# Altium schematic sheet Input_Output_Filtering.SchDoc
size A2; SheetNumber: 11; SheetTotal: 13
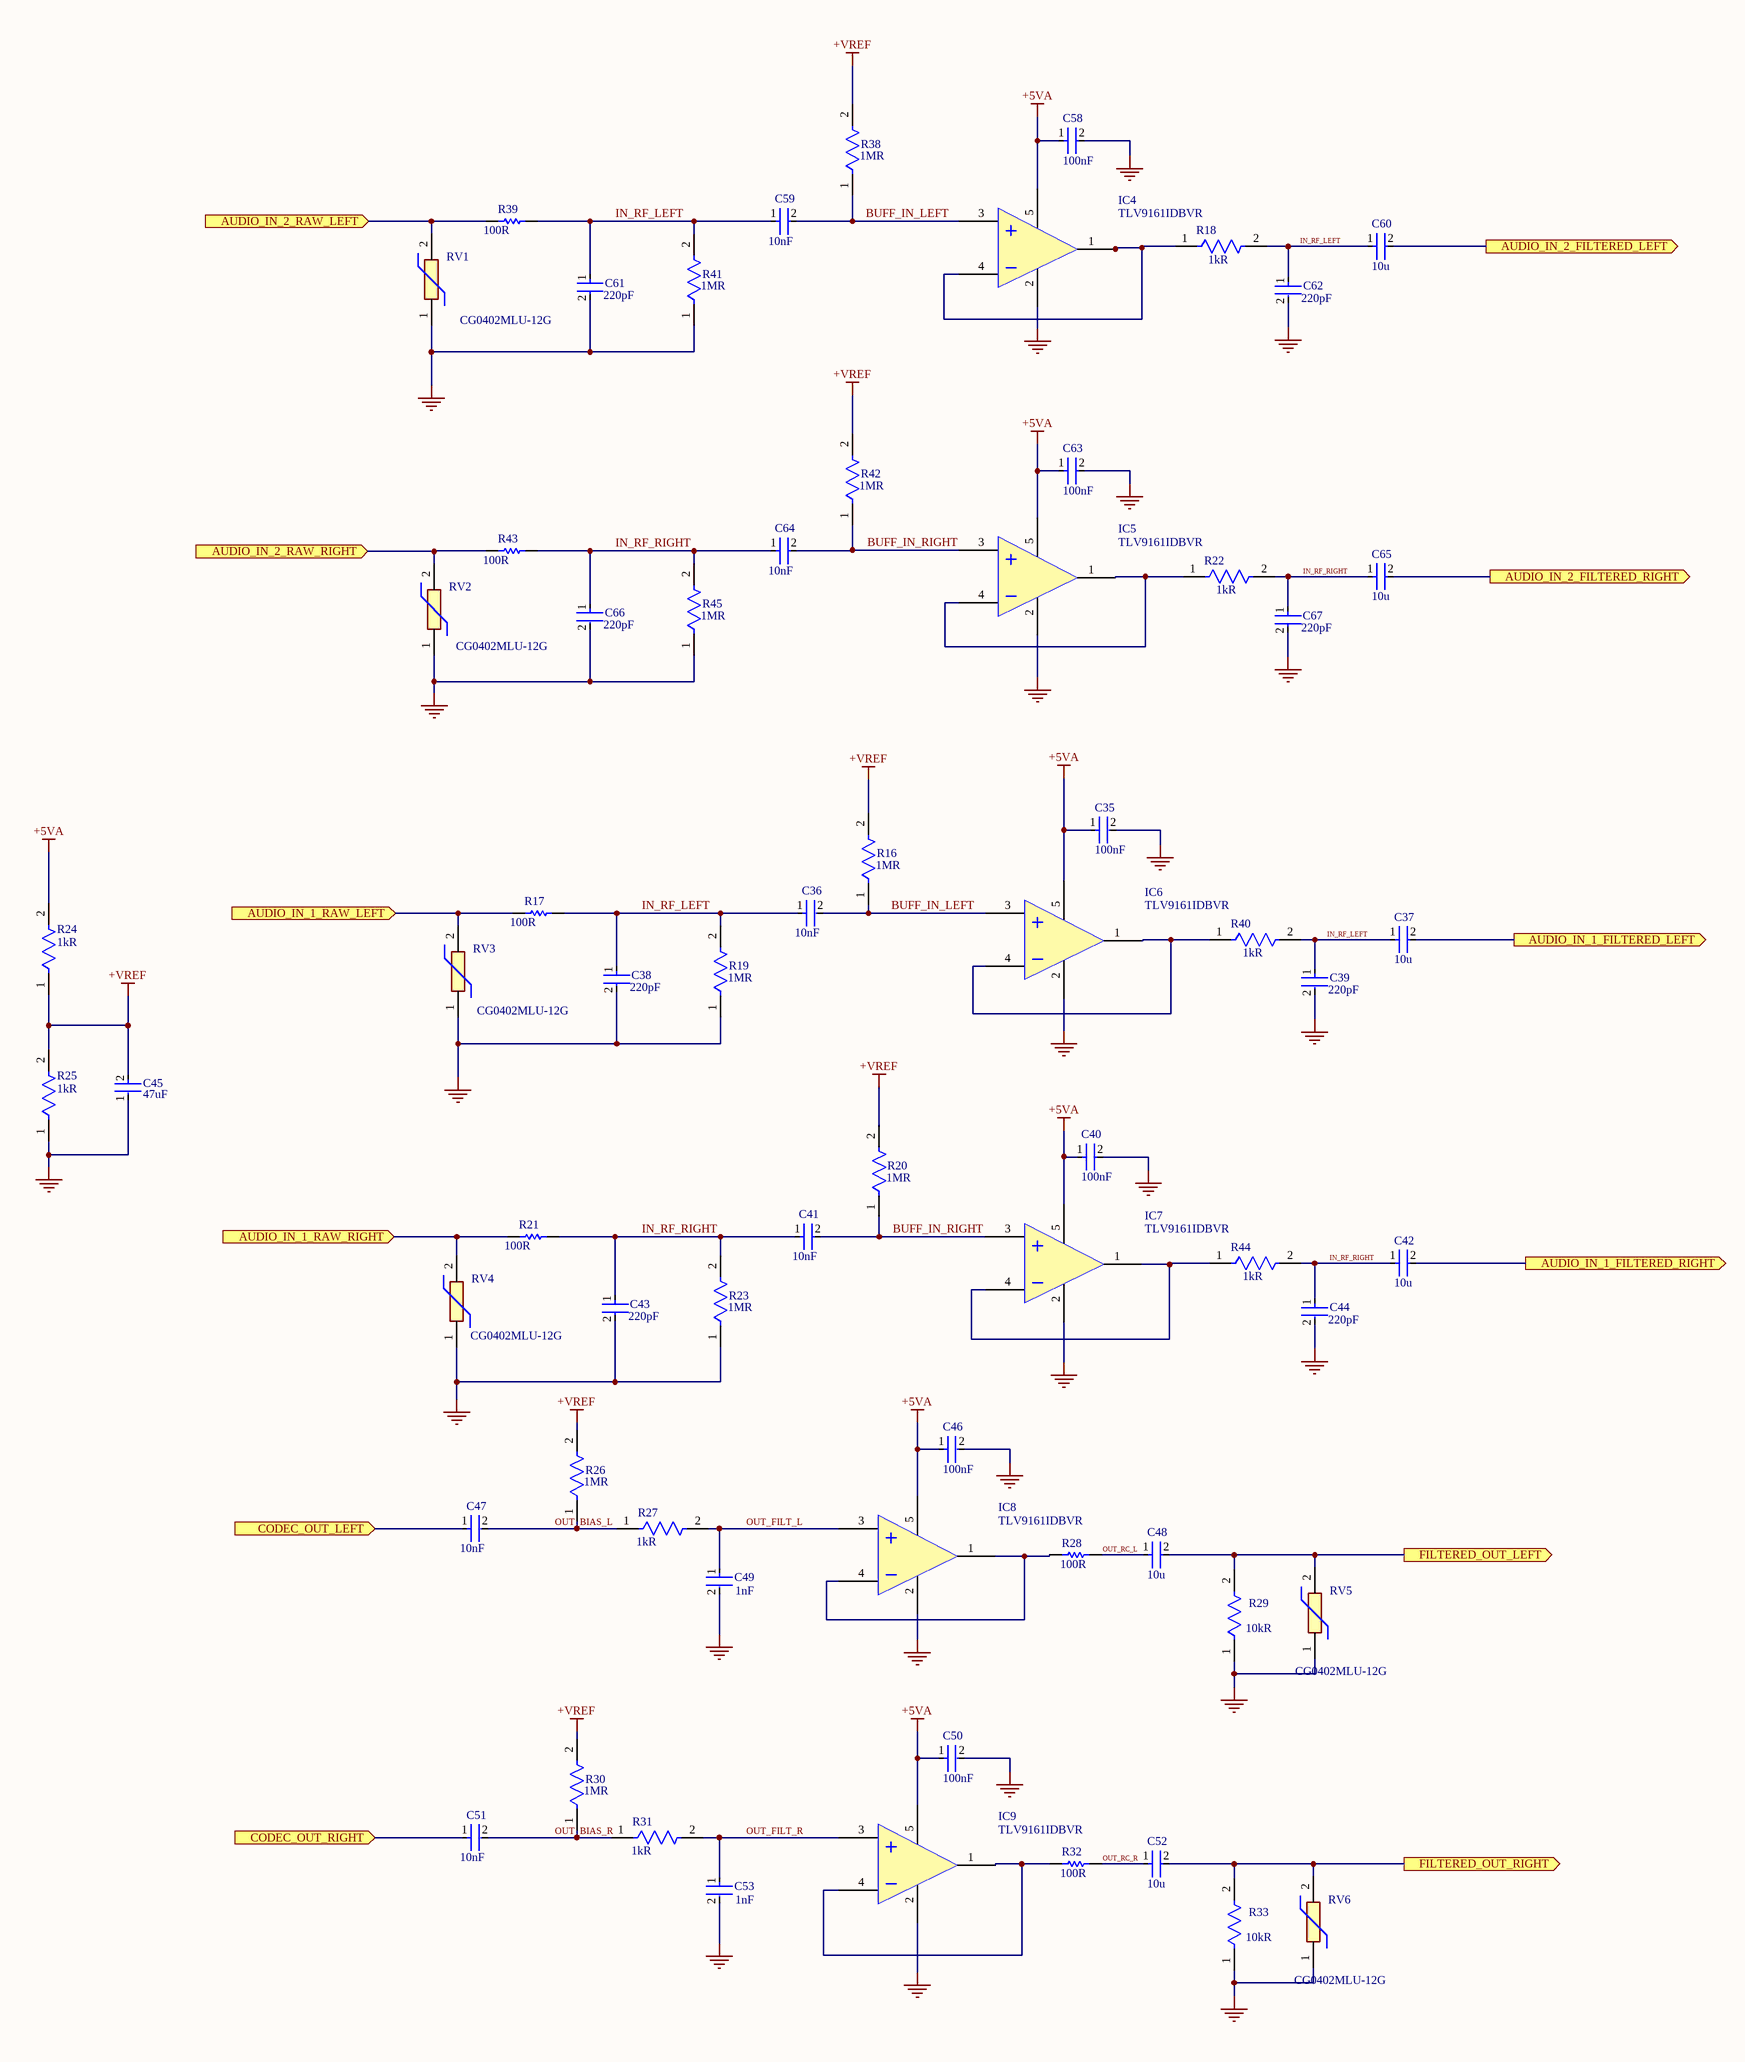
[diagram p0: Input_Output_Filtering.SchDoc]

## Parts
C35  Capacitance: 100nF  [FP-GRM033-0_03-IPC_C]  (hidden comment: GRM033C71C104ME14J)
C36  Capacitance: 10nF  [FP-GCM155-0_05-MFG]  (hidden comment: GCM155R71H103KA55W)
C37  Capacitor: 10u  [FP-GCM188-0_2-IPC_A]  (hidden comment: GCM188D70G106ME36J)
C38  Capacitance: 220pF  [FP-GCM155-0_05-IPC_B]  (hidden comment: GCM155R71H221KA37J)
C39  Capacitance: 220pF  [FP-GCM155-0_05-IPC_B]  (hidden comment: GCM155R71H221KA37J)
C40  Capacitance: 100nF  [FP-GRM033-0_03-IPC_C]  (hidden comment: GRM033C71C104ME14J)
C41  Capacitance: 10nF  [FP-GCM155-0_05-MFG]  (hidden comment: GCM155R71H103KA55W)
C42  Capacitor: 10u  [FP-GCM188-0_2-IPC_A]  (hidden comment: GCM188D70G106ME36J)
C43  Capacitance: 220pF  [FP-GCM155-0_05-IPC_B]  (hidden comment: GCM155R71H221KA37J)
C44  Capacitance: 220pF  [FP-GCM155-0_05-IPC_B]  (hidden comment: GCM155R71H221KA37J)
C45  Capacitance: 47uF  [FP-GCM32E-0_3-MFG]  (hidden comment: GCM32EC71A476KE02K)
C46  Capacitance: 100nF  [FP-GRM033-0_03-IPC_C]  (hidden comment: GRM033C71C104ME14J)
C47  Capacitance: 10nF  [FP-GCM155-0_05-MFG]  (hidden comment: GCM155R71H103KA55W)
C48  Capacitor: 10u  [FP-GCM188-0_2-IPC_A]  (hidden comment: GCM188D70G106ME36J)
C49  Capacitance: 1nF  [FP-GCM155-0_05-IPC_C]  (hidden comment: GCM155R71H102KA37W)
C50  Capacitance: 100nF  [FP-GRM033-0_03-IPC_C]  (hidden comment: GRM033C71C104ME14J)
C51  Capacitance: 10nF  [FP-GCM155-0_05-MFG]  (hidden comment: GCM155R71H103KA55W)
C52  Capacitor: 10u  [FP-GCM188-0_2-IPC_A]  (hidden comment: GCM188D70G106ME36J)
C53  Capacitance: 1nF  [FP-GCM155-0_05-IPC_C]  (hidden comment: GCM155R71H102KA37W)
C58  Capacitance: 100nF  [FP-GRM033-0_03-IPC_C]  (hidden comment: GRM033C71C104ME14J)
C59  Capacitance: 10nF  [FP-GCM155-0_05-MFG]  (hidden comment: GCM155R71H103KA55W)
C60  Capacitor: 10u  [FP-GCM188-0_2-IPC_A]  (hidden comment: GCM188D70G106ME36J)
C61  Capacitance: 220pF  [FP-GCM155-0_05-IPC_B]  (hidden comment: GCM155R71H221KA37J)
C62  Capacitance: 220pF  [FP-GCM155-0_05-IPC_B]  (hidden comment: GCM155R71H221KA37J)
C63  Capacitance: 100nF  [FP-GRM033-0_03-IPC_C]  (hidden comment: GRM033C71C104ME14J)
C64  Capacitance: 10nF  [FP-GCM155-0_05-MFG]  (hidden comment: GCM155R71H103KA55W)
C65  Capacitor: 10u  [FP-GCM188-0_2-IPC_A]  (hidden comment: GCM188D70G106ME36J)
C66  Capacitance: 220pF  [FP-GCM155-0_05-IPC_B]  (hidden comment: GCM155R71H221KA37J)
C67  Capacitance: 220pF  [FP-GCM155-0_05-IPC_B]  (hidden comment: GCM155R71H221KA37J)
IC4  TLV9161IDBVR  [SOT95P280X145-5N]
IC5  TLV9161IDBVR  [SOT95P280X145-5N]
IC6  TLV9161IDBVR  [SOT95P280X145-5N]
IC7  TLV9161IDBVR  [SOT95P280X145-5N]
IC8  TLV9161IDBVR  [SOT95P280X145-5N]
IC9  TLV9161IDBVR  [SOT95P280X145-5N]
R16  Resistance: 1MR  [FP-RC0402-0_4-IPC_A]  (hidden comment: RC0402JR-071ML)
R17  Resistance: 100R  [RESC1005X40X25NL05T10]  (hidden comment: RC0402JR-07100RL)
R18  Resistance: 1kR  [FP-AC0402-IPC_C]  (hidden comment: AC0402JR-071KL)
R19  Resistance: 1MR  [FP-RC0402-0_4-IPC_A]  (hidden comment: RC0402JR-071ML)
R20  Resistance: 1MR  [FP-RC0402-0_4-IPC_A]  (hidden comment: RC0402JR-071ML)
R21  Resistance: 100R  [RESC1005X40X25NL05T10]  (hidden comment: RC0402JR-07100RL)
R22  Resistance: 1kR  [FP-AC0402-IPC_C]  (hidden comment: AC0402JR-071KL)
R23  Resistance: 1MR  [FP-RC0402-0_4-IPC_A]  (hidden comment: RC0402JR-071ML)
R24  Resistance: 1kR  [FP-AC0402-IPC_C]  (hidden comment: AC0402JR-071KL)
R25  Resistance: 1kR  [FP-AC0402-IPC_C]  (hidden comment: AC0402JR-071KL)
R26  Resistance: 1MR  [FP-RC0402-0_4-IPC_A]  (hidden comment: RC0402JR-071ML)
R27  Resistance: 1kR  [FP-AC0402-IPC_C]  (hidden comment: AC0402JR-071KL)
R28  Resistance: 100R  [RESC1005X40X25NL05T10]  (hidden comment: RC0402JR-07100RL)
R29  Resistance: 10kR  [FP-RC0402-0_4-IPC_A]  (hidden comment: RC0402FR-1310KL)
R30  Resistance: 1MR  [FP-RC0402-0_4-IPC_A]  (hidden comment: RC0402JR-071ML)
R31  Resistance: 1kR  [FP-AC0402-IPC_C]  (hidden comment: AC0402JR-071KL)
R32  Resistance: 100R  [RESC1005X40X25NL05T10]  (hidden comment: RC0402JR-07100RL)
R33  Resistance: 10kR  [FP-RC0402-0_4-IPC_A]  (hidden comment: RC0402FR-1310KL)
R38  Resistance: 1MR  [FP-RC0402-0_4-IPC_A]  (hidden comment: RC0402JR-071ML)
R39  Resistance: 100R  [RESC1005X40X25NL05T10]  (hidden comment: RC0402JR-07100RL)
R40  Resistance: 1kR  [FP-AC0402-IPC_C]  (hidden comment: AC0402JR-071KL)
R41  Resistance: 1MR  [FP-RC0402-0_4-IPC_A]  (hidden comment: RC0402JR-071ML)
R42  Resistance: 1MR  [FP-RC0402-0_4-IPC_A]  (hidden comment: RC0402JR-071ML)
R43  Resistance: 100R  [RESC1005X40X25NL05T10]  (hidden comment: RC0402JR-07100RL)
R44  Resistance: 1kR  [FP-AC0402-IPC_C]  (hidden comment: AC0402JR-071KL)
R45  Resistance: 1MR  [FP-RC0402-0_4-IPC_A]  (hidden comment: RC0402JR-071ML)
RV1  CG0402MLU-12G  [VARC1005X41N]
RV2  CG0402MLU-12G  [VARC1005X41N]
RV3  CG0402MLU-12G  [VARC1005X41N]
RV4  CG0402MLU-12G  [VARC1005X41N]
RV5  CG0402MLU-12G  [VARC1005X41N]
RV6  CG0402MLU-12G  [VARC1005X41N]

## Ports
AUDIO_IN_1_FILTERED_LEFT (out, see high_level[6B], Codec[3D]), AUDIO_IN_1_FILTERED_RIGHT (out, see high_level[6B], Codec[4D]), AUDIO_IN_1_RAW_LEFT (in, see high_level[6B], audio_io[3B]), AUDIO_IN_1_RAW_RIGHT (in, see high_level[6B], audio_io[3B]), AUDIO_IN_2_FILTERED_LEFT (out, see high_level[6B], Codec[4D]), AUDIO_IN_2_FILTERED_RIGHT (out, see high_level[6B], Codec[5D]), AUDIO_IN_2_RAW_LEFT (in, see high_level[6C], audio_io[3B]), AUDIO_IN_2_RAW_RIGHT (in, see high_level[6B], audio_io[5B]), CODEC_OUT_LEFT (in, see high_level[6B], Codec[6B]), CODEC_OUT_RIGHT (in, see high_level[6B], Codec[6A]), FILTERED_OUT_LEFT (out, see high_level[6C], audio_io[5B]), FILTERED_OUT_RIGHT (out, see high_level[6C], audio_io[5B])

## Nets
+5VA: C35.1 C40.1 C46.1 C50.1 C58.1 C63.1 IC4.5(V+) IC5.5(V+) IC6.5(V+) IC7.5(V+) IC8.5(V+) IC9.5(V+) R24.2
+VREF: C45.2 R16.2 R20.2 R24.1 R25.2 R26.2 R30.2 R38.2 R42.2
GND: C35.2 C38.2 C39.2 C40.2 C43.2 C44.2 C45.1 C46.2 C49.2 C50.2 C53.2 C58.2 C61.2 C62.2 C63.2 C66.2 C67.2 IC4.2(V-) IC5.2(V-) IC6.2(V-) IC7.2(V-) IC8.2(V-) IC9.2(V-) R19.1 R23.1 R25.1 R29.1 R33.1 R41.1 R45.1 RV1.1 RV2.1 RV3.1 RV4.1 RV5.1 RV6.1
AUDIO_IN_1_FILTERED_LEFT: C37.2 ; port AUDIO_IN_1_FILTERED_LEFT
AUDIO_IN_1_FILTERED_RIGHT: C42.2 ; port AUDIO_IN_1_FILTERED_RIGHT
AUDIO_IN_1_RAW_LEFT: R17.1 RV3.2 ; port AUDIO_IN_1_RAW_LEFT
AUDIO_IN_1_RAW_RIGHT: R21.1 RV4.2 ; port AUDIO_IN_1_RAW_RIGHT
AUDIO_IN_2_FILTERED_LEFT: C60.2 ; port AUDIO_IN_2_FILTERED_LEFT
AUDIO_IN_2_FILTERED_RIGHT: C65.2 ; port AUDIO_IN_2_FILTERED_RIGHT
AUDIO_IN_2_RAW_LEFT: R39.1 RV1.2 ; port AUDIO_IN_2_RAW_LEFT
AUDIO_IN_2_RAW_RIGHT: R43.1 RV2.2 ; port AUDIO_IN_2_RAW_RIGHT
BUFF_IN_LEFT: C36.2 C59.2 IC4.3(IN+) IC6.3(IN+) R16.1 R38.1
BUFF_IN_RIGHT: C41.2 C64.2 IC5.3(IN+) IC7.3(IN+) R20.1 R42.1
CODEC_OUT_LEFT: C47.1 ; port CODEC_OUT_LEFT
CODEC_OUT_RIGHT: C51.1 ; port CODEC_OUT_RIGHT
FILTERED_OUT_LEFT: C48.2 R29.2 RV5.2 ; port FILTERED_OUT_LEFT
FILTERED_OUT_RIGHT: C52.2 R33.2 RV6.2 ; port FILTERED_OUT_RIGHT
IN_RF_LEFT: C36.1 C37.1 C38.1 C39.1 C59.1 C60.1 C61.1 C62.1 R17.2 R18.2 R19.2 R39.2 R40.2 R41.2
IN_RF_RIGHT: C41.1 C42.1 C43.1 C44.1 C64.1 C65.1 C66.1 C67.1 R21.2 R22.2 R23.2 R43.2 R44.2 R45.2
OUT_BIAS_L: C47.2 R26.1 R27.1
OUT_BIAS_R: C51.2 R30.1 R31.1
OUT_FILT_L: C49.1 IC8.3(IN+) R27.2
OUT_FILT_R: C53.1 IC9.3(IN+) R31.2
OUT_RC_L: C48.1 R28.2
OUT_RC_R: C52.1 R32.2
NetIC4_1: IC4.1(OUT) IC4.4(IN-) R18.1
NetIC5_1: IC5.1(OUT) IC5.4(IN-) R22.1
NetIC6_1: IC6.1(OUT) IC6.4(IN-) R40.1
NetIC7_1: IC7.1(OUT) IC7.4(IN-) R44.1
NetIC8_1: IC8.1(OUT) IC8.4(IN-) R28.1
NetIC9_1: IC9.1(OUT) IC9.4(IN-) R32.1

## Library data of the parts
C35 C40 C46 C50 C58 C63 = CMP-06035-001619-1: Chip Multilayer Ceramic Capacitors for General Purpose, 0201, 0.10uF, X7S, 22%, 20%, 16V; Dielectric: X7S; Tolerance: 20%; Length: 600um; Width: 300um; Voltage Rating (DC): 16V; Thickness: 300um
C36 C41 C47 C51 C59 C64 = CMP-06035-055122-1: Ceramic Capacitor for Automotive 10nF ±10% 50VDC X7R 0402 Paper T/R
C37 C42 C48 C52 C60 C65 = CMP-06035-021772-1: Ceramic Capacitor for Automotive 10uF ±20% 4VDC X7T 0603 Paper T/R
C38 C39 C43 C44 C61 C62 C66 C67 = CMP-06035-007229-1: Ceramic Capacitor for Automotive 220pF ±10% 50VDC X7R 0402 Paper T/R; Voltage Rating (DC): 50V; Case Code (Metric): 1005; Max Operating Temperature: 125°C; Case Code (Imperial): 0402; Length: 1mm; Termination: SMD/SMT; Package Quantity: 50000; Min Operating Temperature: -55°C; Radiation Hardening: No; Dielectric: X7R; Packaging: Tape and Reel; Mount: Surface Mount; Case/Package: 0402; Height: 0.5mm; Tolerance: 10%; Depth: 0.5mm; Voltage Rating: 50V
C45 = CMP-06035-055308-1: Ceramic Capacitor for Automotive 47uF ±10% 10VDC X7S 1210 Embossed T/R
C49 C53 = CMP-06035-038116-1: Ceramic Capacitor for Automotive 1nF ±10% 50VDC X7R 0402 Paper T/R
IC4-IC9 = TLV9161IDBVR: Integrated Circuit; Manufacturer_Name: Texas Instruments; Datasheet Link: https://www.ti.com/lit/ds/symlink/tlv9161.pdf?HQS=dis-mous-null-mousermode-dsf-pf-null-wwe&ts=1675947383550&ref_url=https%253A%252F%252Fwww.mouser.de%252F; Height: 1.45mm; Manufacturer_Part_Number: TLV9161IDBVR; Mouser Part Number: 595-TLV9161IDBVR; Mouser Price/Stock: https://www.mouser.co.uk/ProductDetail/Texas-Instruments/TLV9161IDBVR?qs=Rp5uXu7WBW%2FkWJAGvxG3xQ%3D%3D; Arrow Part Number: TLV9161IDBVR; Arrow Price/Stock: https://www.arrow.com/en/products/tlv9161idbvr/texas-instruments?utm_currency=USD&region=nac
R16 R19 R20 R23 R26 R30 R38 R41 R42 R45 = CMP-2002-07947-3: RES SMD 1M OHM 5% 1/16W 0402; Temperature Coefficient: 100ppm/°C; Max Power Dissipation: 63mW; Voltage Rating: 50V; Power Rating: 62.5mW; Tolerance: 5%; Resistance Tolerance: 5%; RoHS Compliant: Yes; Width: 0.02inch; Resistor Type: Thick Film; Case/Package: 0402; Depth: 0.5mm; Case Code (Imperial): 0402; Max Operating Temperature: 155°C; Packaging: Tape and Reel; Length: 1mm; Military Standard: Not; REACH SVHC: No SVHC; Min Operating Temperature: -55°C; Construction: Rectangular; Termination: SMD/SMT; Lead Free: Lead Free; Features: Moisture Resistant; Case Code (Metric): 1005; Package Quantity: 1; Height: 0.016inch; Size Code: 0402; Weight: 2.3E-05oz; Series: RC; Number of Terminations: 2
R17 R21 R28 R32 R39 R43 = CMP-2002-07914-1: Manufacturer: Yageo / Phycomp; Part Number: RC0402JR-07100RL
R18 R22 R24 R25 R27 R31 R40 R44 = CMP-2002-01782-2: RES 1kΩ ±5% 0.063W 0402; Temperature Coefficient: 100ppm/°C; Voltage Rating: 50V; Power Rating: 62.5mW; Max Power Dissipation: 63mW; Termination: SMD/SMT; Series: AC; Features: Moisture Resistant; Lead Free: Lead Free; Height: 0.015inch; Tolerance: 5%; Case/Package: 0402; Case Code (Imperial): 0402; Length: 0.039inch; Resistor Type: Thick Film; Width: 0.5mm; Case Code (Metric): 1005; Number of Terminations: 2; Max Operating Temperature: 155°C; Weight: 2.3E-05oz; Min Operating Temperature: -55°C; RoHS Compliant: Yes; Packaging: Tape and Reel
R29 R33 = CMP-2002-07854-2: RESISTOR 0402 10K 1%; Power Rating: 62.5mW; Voltage Rating (DC): 50V; Temperature Coefficient: 100ppm/°C; REACH SVHC: No SVHC; Case/Package: 0402; Termination: SMD/SMT; Max Operating Temperature: 155°C; Contact Plating: Tin; Resistance Tolerance: 1%; Radiation Hardening: No; Voltage Rating: 50V; Lead Free: Lead Free; Length: 1mm; Depth: 0.5mm; Number of Pins: 2; RoHS Compliant: Yes; Case Code (Imperial): 0402; Case Code (Metric): 1005; Min Operating Temperature: -55°C; Packaging: Tape and Reel; Technology: THICK FILM; Series: RC; Number of Terminations: 2; Resistor Type: Thick Film; Tolerance: 1%; Working Voltage: 50V; Military Standard: Not; Construction: Rectangular
RV1-RV6 = CG0402MLU-12G: Varistor; Manufacturer_Name: Bourns; Datasheet Link: https://bourns.com/docs/product-datasheets/mlu.pdf?sfvrsn=1940d498_27; Height: 0.41mm; Manufacturer_Part_Number: CG0402MLU-12G; Mouser Part Number: 652-CG0402MLU-12G; Mouser Price/Stock: https://www.mouser.co.uk/ProductDetail/Bourns/CG0402MLU-12G?qs=m8myXnDJXpUNz33UIHxVhA%3D%3D; Arrow Part Number: CG0402MLU-12G; Arrow Price/Stock: https://www.arrow.com/en/products/cg0402mlu-12g/bourns?utm_currency=USD&region=nac